# Altium schematic sheet STM32_CONNECTORS.SchDoc
size A4; SheetNumber: 14; SheetTotal: 14
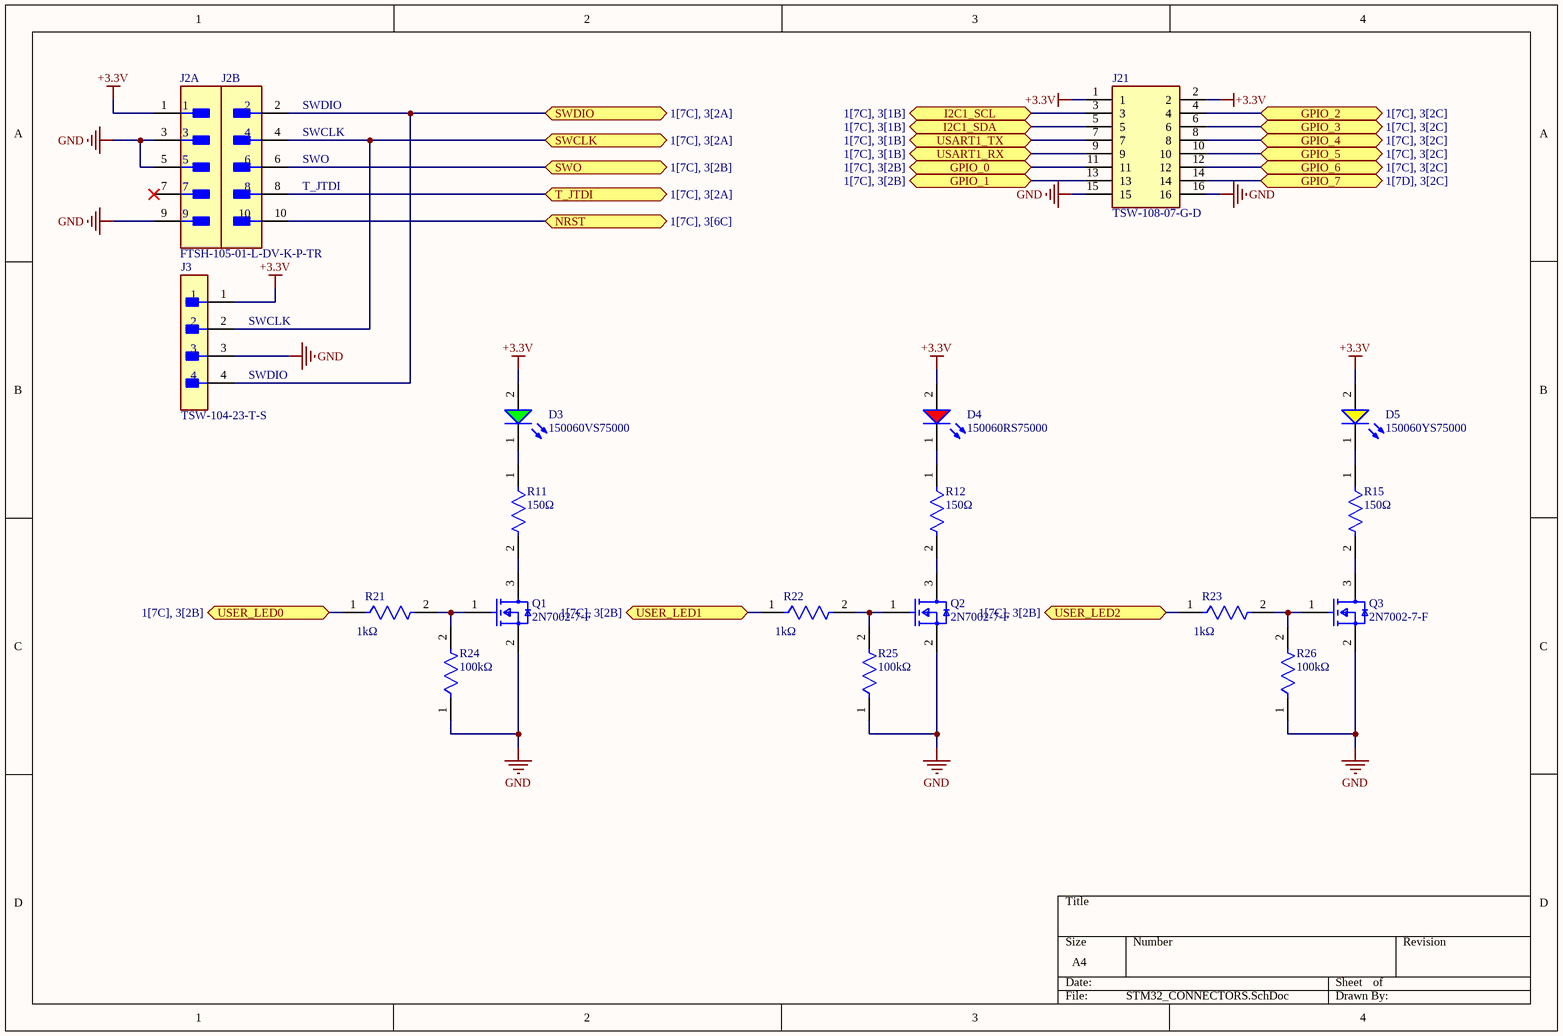
[diagram p0: STM32_CONNECTORS.SchDoc]

## Parts
D3  150060VS75000  [WL-SMCW_0603_150060xx75000]
D4  150060RS75000  [WL-SMCW_0603_150060xx75000]
D5  150060YS75000  [WL-SMCW_0603_150060xx75000]
J2  FTSH-105-01-L-DV-K-P-TR  [FP-FTSH-105-01-L-DV-K-P-T-MFG]  (parts A,B of 2)
J3  TSW-104-23-T-S  [FP-TSW-104-23-T-S-MFG]
J21  TSW-108-07-G-D  [HDRV16W64P254_2X8_2032X508X838P]
Q1  2N7002-7-F  [FP-SOT23-IPC_A]
Q2  2N7002-7-F  [FP-SOT23-IPC_A]
Q3  2N7002-7-F  [FP-SOT23-IPC_A]
R11  Resistance: 150Ω  [FP-CRCW0603-e3-IPC_B]  (hidden comment: CRCW0603150RFKEA)
R12  Resistance: 150Ω  [FP-CRCW0603-e3-IPC_B]  (hidden comment: CRCW0603150RFKEA)
R15  Resistance: 150Ω  [FP-CRCW0603-e3-IPC_B]  (hidden comment: CRCW0603150RFKEA)
R21  Resistance: 1kΩ  [FP-AC0603-IPC_B]  (hidden comment: AC0603FR-071KL)
R22  Resistance: 1kΩ  [FP-AC0603-IPC_B]  (hidden comment: AC0603FR-071KL)
R23  Resistance: 1kΩ  [FP-AC0603-IPC_B]  (hidden comment: AC0603FR-071KL)
R24  Resistance: 100kΩ  [FP-CRCW0603-e3-IPC_B]  (hidden comment: CRCW0603100KFKEC)
R25  Resistance: 100kΩ  [FP-CRCW0603-e3-IPC_B]  (hidden comment: CRCW0603100KFKEC)
R26  Resistance: 100kΩ  [FP-CRCW0603-e3-IPC_B]  (hidden comment: CRCW0603100KFKEC)

## Ports
GPIO_0 (bidir, see 1[7C], 3[2B]), GPIO_1 (bidir, see 1[7C], 3[2B]), GPIO_2 (bidir, see 1[7C], 3[2C]), GPIO_3 (bidir, see 1[7C], 3[2C]), GPIO_4 (bidir, see 1[7C], 3[2C]), GPIO_5 (bidir, see 1[7C], 3[2C]), GPIO_6 (bidir, see 1[7C], 3[2C]), GPIO_7 (bidir, see 1[7D], 3[2C]), I2C1_SCL (bidir, see 1[7C], 3[1B]), I2C1_SDA (bidir, see 1[7C], 3[1B]), NRST (bidir, see 1[7C], 3[6C]), SWCLK (bidir, see 1[7C], 3[2A]), SWDIO (bidir, see 1[7C], 3[2A]), SWO (bidir, see 1[7C], 3[2B]), T_JTDI (bidir, see 1[7C], 3[2A]), USART1_RX (bidir, see 1[7C], 3[1B]), USART1_TX (bidir, see 1[7C], 3[1B]), USER_LED0 (bidir, see 1[7C], 3[2B]), USER_LED1 (bidir, see 1[7C], 3[2B]), USER_LED2 (bidir, see 1[7C], 3[2B])

## Nets
+3.3V: D3.2(A) D4.2(A) D5.2(A) J2.1 J3.1 J21.1 J21.2
GND: J2.3 J2.5 J2.9 J3.3 J21.15 J21.16 Q1.2(S) Q2.2(S) Q3.2(S) R24.1 R25.1 R26.1
GPIO_0: J21.11 ; port GPIO_0
GPIO_1: J21.13 ; port GPIO_1
GPIO_2: J21.4 ; port GPIO_2
GPIO_3: J21.6 ; port GPIO_3
GPIO_4: J21.8 ; port GPIO_4
GPIO_5: J21.10 ; port GPIO_5
GPIO_6: J21.12 ; port GPIO_6
GPIO_7: J21.14 ; port GPIO_7
I2C1_SCL: J21.3 ; port I2C1_SCL
I2C1_SDA: J21.5 ; port I2C1_SDA
NRST: J2.10 ; port NRST
SWCLK: J2.4 J3.2 ; port SWCLK
SWDIO: J2.2 J3.4 ; port SWDIO
SWO: J2.6 ; port SWO
T_JTDI: J2.8 ; port T_JTDI
USART1_RX: J21.9 ; port USART1_RX
USART1_TX: J21.7 ; port USART1_TX
USER_LED0: R21.1 ; port USER_LED0
USER_LED1: R22.1 ; port USER_LED1
USER_LED2: R23.1 ; port USER_LED2
NetD3_1: D3.1(K) R11.1
NetD4_1: D4.1(K) R12.1
NetD5_1: D5.1(K) R15.1
NetQ1_1: Q1.1(G) R21.2 R24.2
NetQ1_3: Q1.3(D) R11.2
NetQ2_1: Q2.1(G) R22.2 R25.2
NetQ2_3: Q2.3(D) R12.2
NetQ3_1: Q3.1(G) R23.2 R26.2
NetQ3_3: Q3.3(D) R15.2

Not connected (* = marked no-connect by the designer): J2 7*

## Notes on the sheet
- (near J2) SWDIO
- (near J2) SWCLK
- (near J2) SWO
- (near J2) T_JTDI
- (near J3) SWCLK
- (near J3) SWDIO

## Library data of the parts
D3 = CMP-1426-00006-6: NexarPartId: 29717778; Reverse Voltage: 5V; Forward Voltage: 2V; Viewing Angle: 140°; Luminous Intensity: 40mcd; Test Current: 20mA; Max Junction Temperature (Tj): 95°C; Wavelength: 570nm; Forward Current: 100mA; Color: Green; Lens Style: Clear, Rectangular; Power Dissipation: 72mW; Peak Wavelength: 572nm; Packaging: Tape and Reel; REACH SVHC: Unknown; Width: 800µm; Max Operating Temperature: 85°C; Number of Pins: 2; RoHS: Compliant; Dominant Wavelength: 570nm; Min Operating Temperature: -40°C; Case Code (Imperial): 0603; Height: 700µm; Length: 1.6mm; Case Code (Metric): 1608; Case/Package: 0603; Max Reverse Voltage (DC): 5V; Mount: Surface Mount
D4 = CMP-1426-00001-3: NexarPartId: 29717776; Color: Red; Power Dissipation: 72mW; Max Reverse Voltage (DC): 5V; Peak Wavelength: 630nm; Viewing Angle: 140°; Forward Voltage: 2V; Luminous Intensity: 250mcd; Forward Current: 100mA; Dominant Wavelength: 625nm; Lens Style: Clear, Rectangular; Max Junction Temperature (Tj): 95°C; Test Current: 20mA; Mount: Surface Mount; Packaging: Tape and Reel; Case Code (Metric): 1608; Max Operating Temperature: 85°C; Case Code (Imperial): 0603; REACH SVHC: Unknown; Width: 800µm; Length: 1.6mm; Reverse Voltage: 5V; Height: 700µm; Case/Package: 0603; RoHS: Compliant; Wavelength: 625nm; Min Operating Temperature: -40°C
D5 = CMP-1426-00005-2: NexarPartId: 29687085; Wavelength: 590nm; Luminous Intensity: 120mcd; Peak Wavelength: 595nm; Forward Current: 100mA; Power Dissipation: 72mW; Color: Yellow; Forward Voltage: 2V; Test Current: 20mA; Reverse Voltage: 5V; Lens Style: Clear, Rectangular; Max Junction Temperature (Tj): 95°C; Viewing Angle: 140°; Case Code (Imperial): 0603; Height: 700µm; REACH SVHC: Unknown; Dominant Wavelength: 590nm; Min Operating Temperature: -40°C; Width: 800µm; Mount: Surface Mount; Packaging: Tape and Reel; Max Operating Temperature: 85°C; RoHS: Compliant; Max Reverse Voltage (DC): 5V; Case Code (Metric): 1608; Length: 1.6mm; Case/Package: 0603
J2 = CMP-2000-06292-2: CONN HEADER SMD 10POS 1.27MM; Gender: Male; Max Current Rating: 1.75A; Number of Contacts: 10; Contact Material: Bronze; Pitch: 1.27mm; Contact Plating: Gold; Orientation: Straight; RoHS Compliant: Yes; Housing Material: Polymer; Housing Color: Black; Length: 6.35mm; Number of Rows: 2; Lead Free: Lead Free; Max Operating Temperature: 125°C; Min Operating Temperature: -55°C; Radiation Hardening: No; Termination: Solder; Depth: 5.84mm; Packaging: Tape and Reel
J3 = CMP-02766-001388-1: CONN HEADER VERT 4POS 2.54MM; Number of Contacts: 4; Gender: Male; Connector Type: Male Pin; Max Voltage Rating (AC): 550V; Max Current Rating: 7.6A; Radiation Hardening: No; Lead Free: Lead Free; RoHS Compliant: Yes; Contact Material: Bronze; Number of Positions: 4; Housing Color: Black; Min Operating Temperature: -55°C; Mount: Through Hole; Number of Rows: 1; Orientation: Straight; Contact Mating Length: 0.23inch; Contact Type: Male Pin; REACH SVHC: No SVHC; Max Operating Temperature: 105°C; Color: Black; Pitch: 2.54mm; Length: 10.16mm; Series: TSW; Packaging: Bulk; Contact Plating: Tin; Package Quantity: 1; Termination: Solder; Housing Material: Polyester; Width: 2.54mm; Depth: 2.54mm
J21 = TSW-108-07-G-D: Connector; Manufacturer_Name: SAMTEC; Datasheet Link: https://suddendocs.samtec.com/catalog_english/tsw_th.pdf?_gl=1*vxrzbc*_ga*MTk4NDk3MDkyNi4xNjgxOTY2Mjg5*_ga_3KFNZC07WW*MTY4MzYyNDMyNC4zLjEuMTY4MzYyNDM4NC42MC4wLjA.; Height: 8.38mm; Manufacturer_Part_Number: TSW-108-07-G-D; Mouser Part Number: 200-TSW10807GD; Mouser Price/Stock: https://www.mouser.co.uk/ProductDetail/Samtec/TSW-108-07-G-D?qs=jyzYFa4oMQg0kuHhXNXiwg%3D%3D; Arrow Part Number: TSW-108-07-G-D; Arrow Price/Stock: https://www.arrow.com/en/products/tsw-108-07-g-d/samtec?region=nac
Q1-Q3 = CMP-2000-04929-2: MOSFET N-CH 60V 115MA SOT23-3; Turn-On Delay Time: 7ns; Turn-Off Delay Time: 11ns; Drain to Source Resistance: 7.5R; Rise Time: 3ns; Drain to Source Breakdown Voltage: 70V; Input Capacitance: 50pF; Number of Elements: 1; Power Dissipation: 540mW; Max Power Dissipation: 300mW; Fall Time: 5.6ns; Gate to Source Voltage (Vgs): 20V; Threshold Voltage: 2.5V; Element Configuration: Single; Termination: SMD/SMT; Weight: 0.000282oz; Radiation Hardening: No; Max Operating Temperature: 150°C; On-State Resistance: 7.5R; Mount: Surface Mount; Current Rating: 115mA; Contact Plating: Tin; Lead Free: Lead Free; Min Operating Temperature: -55°C; Number of Pins: 3; REACH SVHC: No SVHC; Drain to Source Voltage (Vdss): 60V; Width: 1.3mm; Package Quantity: 3000; Length: 2.9mm; Case/Package: SOT-23; Number of Channels: 1; Dual Supply Voltage: 60V; Packaging: Tape and Reel; Height: 1mm; Voltage Rating (DC): 60V; Nominal Vgs: 2.5V; Continuous Drain Current (ID): 115mA; Voltage: 60V; Rds On Max: 7.5R
R11 R12 R15 = CMP-2000-03913-2: RES Thick Film, 150Ω, 1%, 0.1W, 100ppm/°C, 0603; Voltage Rating (DC): 75V; Max Power Dissipation: 100mW; Features: Automotive AEC-Q200; Weight: 7.1E-05oz; Number of Terminations: 2; Temperature Coefficient: 100ppm/°C; Military Standard: Not; Length: 1.55mm; Min Operating Temperature: -55°C; Termination: SMD/SMT; Tolerance: 1%; Composition: Thick Film; Depth: 0.85mm; Max Operating Temperature: 155°C; Width: 0.033inch; Lead Free: Lead Free; Height: 0.45mm; Case Code (Metric): 1608; Package Quantity: 10; Case Code (Imperial): 0603; Voltage Rating: 75V; Radiation Hardening: No; Contact Plating: Tin; Mount: Surface Mount; Packaging: Tape and Reel; Power Rating: 100mW; Case/Package: 0603
R21-R23 = CMP-2000-04828-3: RES 1kΩ 1.00% 0.1W 0603; Voltage Rating: 50V; Power Rating: 100mW; Tolerance: 1%; Temperature Coefficient: 100ppm/°C; Depth: 0.8mm; Case/Package: 0603; Size Code: 0603; Case Code (Metric): 1608; Height: 0.022inch; Series: AC; Width: 0.031inch; Construction: Rectangular; Length: 0.063inch; Case Code (Imperial): 0603; Package Quantity: 1; RoHS Compliant: Yes; Features: Moisture Resistant; Resistor Type: Thick Film; Max Power Dissipation: 100mW; Packaging: Tape and Reel; Termination: SMD/SMT; Ratings: AEC-Q200; Max Operating Temperature: 155°C; Min Operating Temperature: -55°C; Military Standard: Not; Lead Free: Lead Free; Number of Terminations: 2
R24-R26 = CMP-2000-03822-2: RES Thick Film, 100kΩ, 1%, 0.1W, 100ppm/°C, 0603; Power Rating: 100mW; Height: 0.02inch; Min Operating Temperature: -55°C; Length: 0.061inch; Temperature Coefficient: 100ppm/°C; Number of Terminations: 2; Packaging: Tape and Reel; Case Code (Imperial): 0603; Case/Package: 0603; Contact Plating: Tin; Radiation Hardening: No; Lead Free: Lead Free; Depth: 0.85mm; Case Code (Metric): 1608; Max Power Dissipation: 100mW; Features: Automotive AEC-Q200; Tolerance: 1%; Max Operating Temperature: 155°C; Composition: Thick Film; Military Standard: Not; Width: 0.033inch